# Altium schematic sheet CPU.SchDoc
size A3
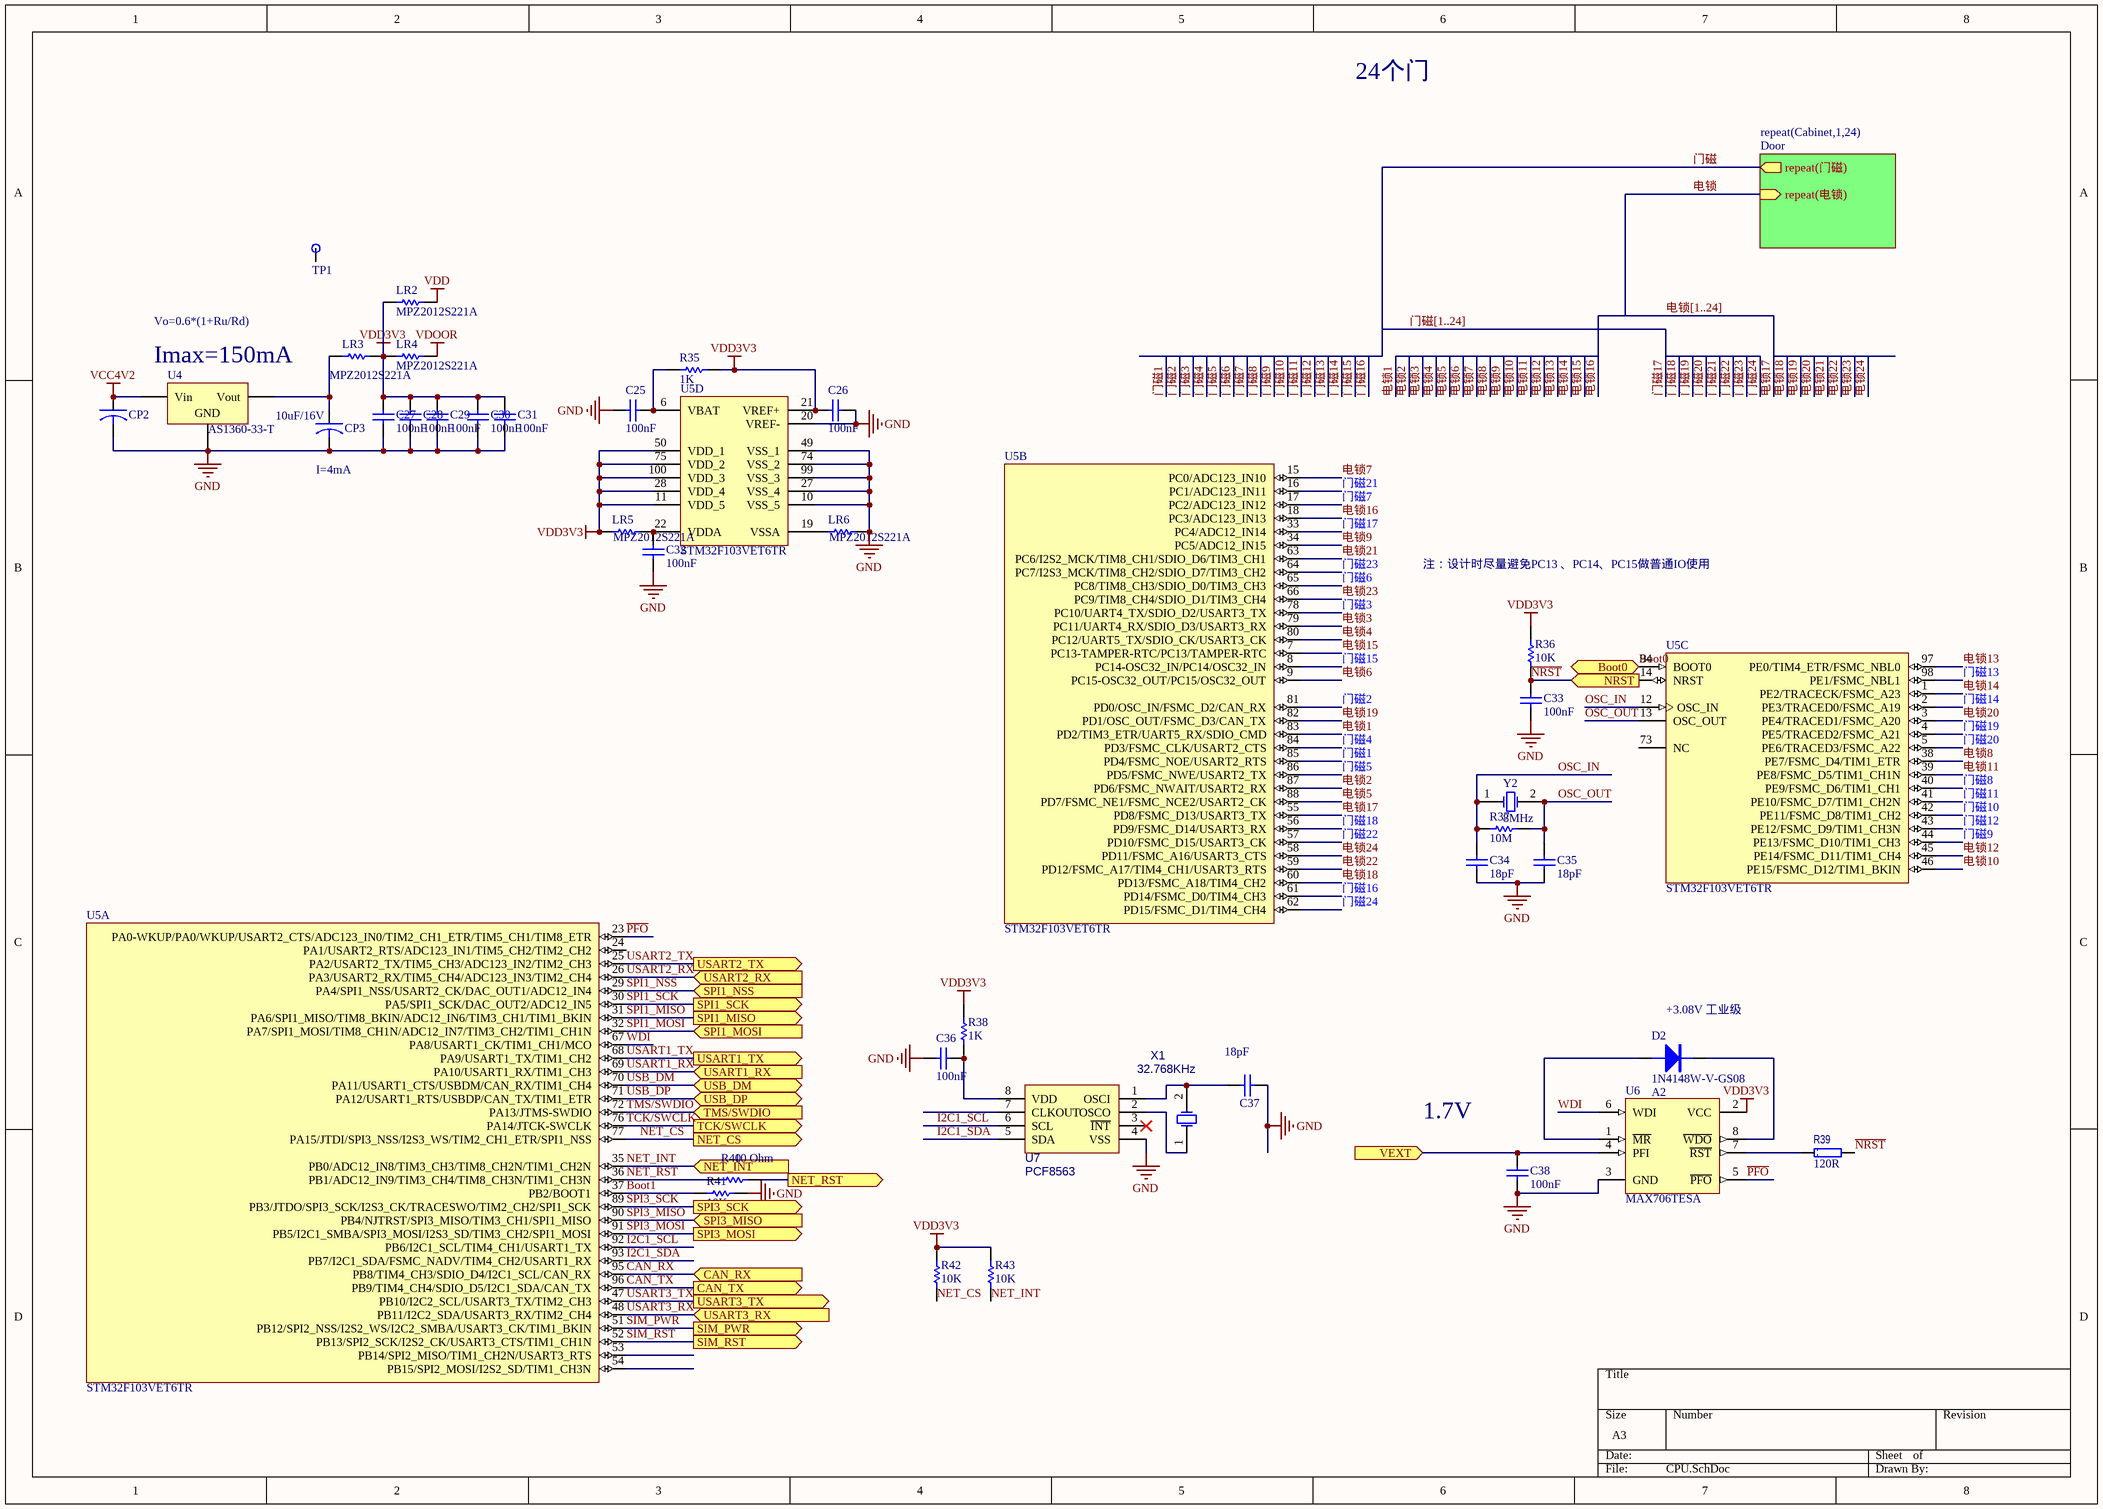
[diagram p0: CPU.SchDoc]

## Parts
C25  value 100nF  [2012[0805]06CD]  (hidden comment: CAP 100nF 50V 0805(2012))
C26  value 100nF  [2012[0805]06CD]  (hidden comment: CAP 100nF 50V 0805(2012))
C27  value 100nF  [2012[0805]06CD]  (hidden comment: CAP 100nF 50V 0805(2012))
C28  value 100nF  [2012[0805]06CD]  (hidden comment: CAP 100nF 50V 0805(2012))
C29  value 100nF  [2012[0805]06CD]  (hidden comment: CAP 100nF 50V 0805(2012))
C30  value 100nF  [2012[0805]06CD]  (hidden comment: CAP 100nF 50V 0805(2012))
C31  value 100nF  [2012[0805]06CD]  (hidden comment: CAP 100nF 50V 0805(2012))
C32  value 100nF  [2012[0805]06CD]  (hidden comment: CAP 100nF 50V 0805(2012))
C33  value 100nF  [2012[0805]06CD]  (hidden comment: CAP 100nF 50V 0805(2012))
C34  value 18pF  [2012[0805]100_L]  (hidden comment: CAP 18pF 50V 0805(2012))
C35  value 18pF  [2012[0805]100_L]  (hidden comment: CAP 18pF 50V 0805(2012))
C36  value 100nF  [2012[0805]06CD]  (hidden comment: CAP 100nF 50V 0805(2012))
C37  value 18pF  [2012[0805]100_L]  (hidden comment: CAP 18pF 50V 0805(2012))
C38  value 100nF  [2012[0805]06CD]  (hidden comment: CAP 100nF 50V 0805(2012))
CP2  TAJA106K016RNJ  [3216[1206]CB]  (value not drawn)
CP3  value 10uF/16V  [3216[1206]CB]  (hidden comment: TAJA106K016RNJ)
D2  1N4148W-V-GS08  value A2  [SOD123]
LR2  MPZ2012S221A  [2012[0805]RL]
LR3  MPZ2012S221A  [2012[0805]RL]
LR4  MPZ2012S221A  [2012[0805]RL]
LR5  MPZ2012S221A  [2012[0805]RL]
LR6  MPZ2012S221A  [2012[0805]RL]
R35  value 1K  [2012[0805]R]  (hidden comment: 1K 1% 0805(2012))
R36  value 10K  [2012[0805]R]  (hidden comment: 10K 1% 0805(2012))
R37  value 10M  [2012[0805]R]  (hidden comment: 10M 1% 0805(2012))
R38  value 1K  [2012[0805]R]  (hidden comment: 1K 1% 0805(2012))
R39  value 120R  [2012[0805]R]  (hidden comment: CRCW0603120RFKEA)
R40  value 10 Ohm  [2012[0805]R]  (hidden comment: 10R 5% 0805(2012))
R41  value 10K  [2012[0805]R]  (hidden comment: 10K 1% 0805(2012))
R42  value 10K  [2012[0805]R]  (hidden comment: 10K 1% 0805(2012))
R43  value 10K  [2012[0805]R]  (hidden comment: 10K 1% 0805(2012))
TP1  TP  [TP]  (value not drawn)
U4  AS1360-33-T  [SOT23_N]
U5  STM32F103VET6TR  [STM-LQFP100_M]  (parts A,B,C,D of 4)
U6  MAX706TESA  [SOIC8_N]
U7  PCF8563  [SOIC8_N]
X1  32.768KHz  [XTAL32]
Y2  8MHz  [XTAL_HC-49]

## Sub-sheets
repeat(Cabinet,1,24) = Door: repeat(门磁) (out), repeat(电锁) (in)

## Ports
Boot0 (in), CAN_RX (in), CAN_TX (out), NET_CS (out), NET_INT (in), NET_RST (out), NRST (in), SIM_PWR (out), SIM_RST (out), SPI1_MISO (out), SPI1_MOSI (in), SPI1_NSS (in), SPI1_SCK (out), SPI3_MISO (in), SPI3_MOSI (out), SPI3_SCK (out), TCK/SWCLK (out), TMS/SWDIO (in), USART1_RX (in), USART1_TX (out), USART2_RX (in), USART2_TX (out), USART3_RX (in), USART3_TX (out), USB_DM, USB_DP, VEXT (in)

## Nets
GND: C25.2 C26.2 C27.2 C28.2 C29.2 C30.2 C31.2 C32.2 C33.2 C34.2 C35.2 C36.2 C37.2 C38.2 CP2.2 CP3.2 LR6.2 R41.1 U4.1(GND) U5.10(VSS_5) U5.20(VREF-) U5.27(VSS_4) U5.49(VSS_1) U5.74(VSS_2) U5.99(VSS_3) U6.3(GND) U7.4(VSS)
VCC4V2: CP2.1 U4.3(Vin)
VDD: LR2.2
VDD3V3: C26.1 C27.1 C28.1 C29.1 C30.1 C31.1 LR2.1 LR3.1 LR4.1 LR5.1 R35.1 R36.2 R38.1 R42.1 R43.1 U5.11(VDD_5) U5.21(VREF+) U5.28(VDD_4) U5.50(VDD_1) U5.75(VDD_2) U5.100(VDD_3) U6.2(VCC)
VDOOR: LR4.2
Boot0: U5.94(BOOT0) ; port Boot0
Boot1: R41.2 U5.37(PB2/BOOT1)
CAN_RX: U5.95(PB8/TIM4_CH3/SDIO_D4/I2C1_SCL/CAN_RX) ; port CAN_RX
CAN_TX: U5.96(PB9/TIM4_CH4/SDIO_D5/I2C1_SDA/CAN_TX) ; port CAN_TX
I2C1_SCL: U5.92(PB6/I2C1_SCL/TIM4_CH1/USART1_TX) U7.6(SCL)
I2C1_SDA: U5.93(PB7/I2C1_SDA/FSMC_NADV/TIM4_CH2/USART1_RX) U7.5(SDA)
~{NRST}: C33.1 R36.1 R39.2 U5.14(NRST) ; port NRST
NET_CS: R42.2 U5.77(PA15/JTDI/SPI3_NSS/I2S3_WS/TIM2_CH1_ETR/SPI1_NSS) ; port NET_CS
NET_INT: R43.2 U5.35(PB0/ADC12_IN8/TIM3_CH3/TIM8_CH2N/TIM1_CH2N) ; port NET_INT
NET_RST: R40.2 U5.36(PB1/ADC12_IN9/TIM3_CH4/TIM8_CH3N/TIM1_CH3N)
NET_RST: R40.1 ; port NET_RST  [a separate net that carries the same name]
OSC_IN: C34.1 R37.1 U5.12(OSC_IN) Y2.1(OSC1)
OSC_OUT: C35.1 R37.2 U5.13(OSC_OUT) Y2.2(OSC2)
~{PFO}: U5.23(PA0-WKUP/PA0/WKUP/USART2_CTS/ADC123_IN0/TIM2_CH1_ETR/TIM5_CH1/TIM8_ETR) U6.5(~{PFO})
SIM_PWR: U5.51(PB12/SPI2_NSS/I2S2_WS/I2C2_SMBA/USART3_CK/TIM1_BKIN) ; port SIM_PWR
SIM_RST: U5.52(PB13/SPI2_SCK/I2S2_CK/USART3_CTS/TIM1_CH1N) ; port SIM_RST
SPI1_MISO: U5.31(PA6/SPI1_MISO/TIM8_BKIN/ADC12_IN6/TIM3_CH1/TIM1_BKIN) ; port SPI1_MISO
SPI1_MOSI: U5.32(PA7/SPI1_MOSI/TIM8_CH1N/ADC12_IN7/TIM3_CH2/TIM1_CH1N) ; port SPI1_MOSI
SPI1_NSS: U5.29(PA4/SPI1_NSS/USART2_CK/DAC_OUT1/ADC12_IN4) ; port SPI1_NSS
SPI1_SCK: U5.30(PA5/SPI1_SCK/DAC_OUT2/ADC12_IN5) ; port SPI1_SCK
SPI3_MISO: U5.90(PB4/NJTRST/SPI3_MISO/TIM3_CH1/SPI1_MISO) ; port SPI3_MISO
SPI3_MOSI: U5.91(PB5/I2C1_SMBA/SPI3_MOSI/I2S3_SD/TIM3_CH2/SPI1_MOSI) ; port SPI3_MOSI
SPI3_SCK: U5.89(PB3/JTDO/SPI3_SCK/I2S3_CK/TRACESWO/TIM2_CH2/SPI1_SCK) ; port SPI3_SCK
TCK/SWCLK: U5.76(PA14/JTCK-SWCLK) ; port TCK/SWCLK
TMS/SWDIO: U5.72(PA13/JTMS-SWDIO) ; port TMS/SWDIO
USART1_RX: U5.69(PA10/USART1_RX/TIM1_CH3) ; port USART1_RX
USART1_TX: U5.68(PA9/USART1_TX/TIM1_CH2) ; port USART1_TX
USART2_RX: U5.26(PA3/USART2_RX/TIM5_CH4/ADC123_IN3/TIM2_CH4) ; port USART2_RX
USART2_TX: U5.25(PA2/USART2_TX/TIM5_CH3/ADC123_IN2/TIM2_CH3) ; port USART2_TX
USART3_RX: U5.48(PB11/I2C2_SDA/USART3_RX/TIM2_CH4) ; port USART3_RX
USART3_TX: U5.47(PB10/I2C2_SCL/USART3_TX/TIM2_CH3) ; port USART3_TX
USB_DM: U5.70(PA11/USART1_CTS/USBDM/CAN_RX/TIM1_CH4) ; port USB_DM
USB_DP: U5.71(PA12/USART1_RTS/USBDP/CAN_TX/TIM1_ETR) ; port USB_DP
VEXT: C38.1 U6.4(PFI) ; port VEXT
WDI: U5.67(PA8/USART1_CK/TIM1_CH1/MCO) U6.6(WDI)
电锁: sheet repeat(Cabinet,1,24)/repeat(电锁)
电锁1: U5.83(PD2/TIM3_ETR/UART5_RX/SDIO_CMD)
电锁2: U5.87(PD6/FSMC_NWAIT/USART2_RX)
电锁3: U5.79(PC11/UART4_RX/SDIO_D3/USART3_RX)
电锁4: U5.80(PC12/UART5_TX/SDIO_CK/USART3_CK)
电锁5: U5.88(PD7/FSMC_NE1/FSMC_NCE2/USART2_CK)
电锁6: U5.9(PC15-OSC32_OUT/PC15/OSC32_OUT)
电锁7: U5.15(PC0/ADC123_IN10)
电锁8: U5.38(PE7/FSMC_D4/TIM1_ETR)
电锁9: U5.34(PC5/ADC12_IN15)
电锁10: U5.46(PE15/FSMC_D12/TIM1_BKIN)
电锁11: U5.39(PE8/FSMC_D5/TIM1_CH1N)
电锁12: U5.45(PE14/FSMC_D11/TIM1_CH4)
电锁13: U5.97(PE0/TIM4_ETR/FSMC_NBL0)
电锁14: U5.1(PE2/TRACECK/FSMC_A23)
电锁15: U5.7(PC13-TAMPER-RTC/PC13/TAMPER-RTC)
电锁16: U5.18(PC3/ADC123_IN13)
电锁17: U5.55(PD8/FSMC_D13/USART3_TX)
电锁18: U5.60(PD13/FSMC_A18/TIM4_CH2)
电锁19: U5.82(PD1/OSC_OUT/FSMC_D3/CAN_TX)
电锁20: U5.3(PE4/TRACED1/FSMC_A20)
电锁21: U5.63(PC6/I2S2_MCK/TIM8_CH1/SDIO_D6/TIM3_CH1)
电锁22: U5.59(PD12/FSMC_A17/TIM4_CH1/USART3_RTS)
电锁23: U5.66(PC9/TIM8_CH4/SDIO_D1/TIM3_CH4)
电锁24: U5.58(PD11/FSMC_A16/USART3_CTS)
门磁: sheet repeat(Cabinet,1,24)/repeat(门磁)
门磁1: U5.85(PD4/FSMC_NOE/USART2_RTS)
门磁2: U5.81(PD0/OSC_IN/FSMC_D2/CAN_RX)
门磁3: U5.78(PC10/UART4_TX/SDIO_D2/USART3_TX)
门磁4: U5.84(PD3/FSMC_CLK/USART2_CTS)
门磁5: U5.86(PD5/FSMC_NWE/USART2_TX)
门磁6: U5.65(PC8/TIM8_CH3/SDIO_D0/TIM3_CH3)
门磁7: U5.17(PC2/ADC123_IN12)
门磁8: U5.40(PE9/FSMC_D6/TIM1_CH1)
门磁9: U5.44(PE13/FSMC_D10/TIM1_CH3)
门磁10: U5.42(PE11/FSMC_D8/TIM1_CH2)
门磁11: U5.41(PE10/FSMC_D7/TIM1_CH2N)
门磁12: U5.43(PE12/FSMC_D9/TIM1_CH3N)
门磁13: U5.98(PE1/FSMC_NBL1)
门磁14: U5.2(PE3/TRACED0/FSMC_A19)
门磁15: U5.8(PC14-OSC32_IN/PC14/OSC32_IN)
门磁16: U5.61(PD14/FSMC_D0/TIM4_CH3)
门磁17: U5.33(PC4/ADC12_IN14)
门磁18: U5.56(PD9/FSMC_D14/USART3_RX)
门磁19: U5.4(PE5/TRACED2/FSMC_A21)
门磁20: U5.5(PE6/TRACED3/FSMC_A22)
门磁21: U5.16(PC1/ADC123_IN11)
门磁22: U5.57(PD10/FSMC_D15/USART3_CK)
门磁23: U5.64(PC7/I2S3_MCK/TIM8_CH2/SDIO_D7/TIM3_CH2)
门磁24: U5.62(PD15/FSMC_D1/TIM4_CH4)
NetC25_1: C25.1 R35.2 U5.6(VBAT)
NetC32_1: C32.1 LR5.2 U5.22(VDDA)
NetC36_1: C36.1 R38.2 U7.8(VDD)
NetC37_1: C37.1 U7.1(OSCI) X1.2(OSC2)
NetCP3_1: CP3.1 LR3.2 U4.2(Vout)
NetD2_1: D2.1(A) U6.1(~{MR})
NetD2_2: D2.2(K) U6.8(~{WDO})
NetLR6_1: LR6.1 U5.19(VSSA)
NetR39_1: R39.1 U6.7(~{RST})
NetU7_2: U7.2(OSCO) X1.1(OSC1)

Not connected (* = marked no-connect by the designer): TP1 1(TestPoint); U5 24(PA1/USART2_RTS/ADC123_IN1/TIM5_CH2/TIM2_CH2) 53(PB14/SPI2_MISO/TIM1_CH2N/USART3_RTS) 54(PB15/SPI2_MOSI/I2S2_SD/TIM1_CH3N) 73(NC); U7 3(~{INT})* 7(CLKOUT)

## Buses and harness runs
bus 电锁[1..24]
bus 门磁[1..24]

## Notes on the sheet
- 24个门
- (near U4) Imax=150mA
- Vo=0.6*(1+Ru/Rd)
- (near CP3) I=4mA
- 注：设计时尽量避免PC13 、PC14、PC15做普通IO使用
- (near D2) +3.08V 工业级
- 1.7V

## Library data of the parts
C25-C32 C36 = CMP-1036-04418-1: CAP 100nF 50V ±5% 0805 (2012 Metric) Thickness 1mm SMD; Case-EIA: 0805; Case-Metric: 2012; Tolerance: ±5%; Max Thickness: 1 mm; Technology: SMT; Rated Voltage: 50 V
C33 C38 = CMP-1036-04417-1: CAP 100nF 50V ±5% 0805 (2012 Metric) Thickness 1.45mm SMD; Case-Metric: 2012; Case-EIA: 0805; Max Thickness: 1.45 mm; Tolerance: ±5%; Rated Voltage: 50 V; Technology: SMT
C34 C35 C37 = CMP-1036-01136-1: CAP 18pF 50V ±1% 0805 (2012 Metric) Thickness 0.75mm SMD; Case-EIA: 0805; Case-Metric: 2012; Technology: SMT; Tolerance: ±1%; Max Thickness: 0.75 mm; Rated Voltage: 50 V
CP2 CP3 = CAPACITOR: 钽质电容器-固体SMD 16volts 10uF 10%; Manufacturer: AVX; ESR: 3 Ohms; 产品: Tantalum Solid Standard Grade - Other Various; 产品种类: SMD Tantalum Capacitors; 制造商库存号: A Case; 外壳代码 - in: 1206; 外壳代码 - mm: 3216; 封装 / 箱体: 1206 (3216 metric); 封装: Reel; 尺寸: 1.6 mm W x 3.2 mm L; 工作温度范围: - 55 C to + 125 C; 损耗因数 DF: 8; 标准包装数量: 2000; 漏泄电流: 1.6 uA; 电压额定值: 16 V; 端接类型: SMD/SMT; 系列: TAJ; 高度: 1.8 mm; Category: 钽质电容器-固体SMD; ComponentLink1Description: http://www.avx.com/docs/Catalogs/taj.pdf; ComponentLink1URL: http://www.avx.com/docs/Catalogs/taj.pdf; Description 1: 钽质电容器-固体SMD 16volts 10uF 10%; Manufacturer Part Number: TAJA106K016RNJ; Minimum Order Quantity: 1; Pricing 1: 1=0.600, 100=0.280, 200=0.250, 500=0.221, 1000=0.200, 2000=0.140, 5000=0.131, 10000=0.124, 25000=0.103 (USD); Reeling: True; RoHS - 贸泽: Y; RoHS: RoHS Compliant; Stock 1: 20335; Supplier 1: Mouser; Supplier Part Number 1: 581-TAJA106K016R; 制造商: AVX; 容差: 10 %; 电容: 10 uF
D2 = 1N4148W: 二极管 - 通用，功率，开关 100V Io/150mA; Manufacturer: Vishay Semiconductors; 配置: Single; 工作温度范围: - 65 C to + 150 C; 封装 / 箱体: SOD-123; 封装: Reel; 产品: Switching Diodes; 正向连续电流: 0.15 A; 最大浪涌电流: 0.5 A; 安装风格: SMD/SMT; 恢复时间: 4 ns; 正向电压下降: 1.2 V; 制造商: Vishay; 最大二极管电容: 4 pF; 最大工作温度: + 150 C; 最大功率耗散: 350 mW; 最大反向漏泄电流: 5 uA; 最小工作温度: - 65 C; 标准包装数量: 15000; Supplier 1: Mouser; Supplier Part Number 1: 625-1N4148W-V; Manufacturer Part Number: 1N4148W-V-GS08; RoHS: RoHS Compliant; Category: 二极管 - 通用，功率，开关; Stock 1: 404148; Pricing 1: 1=0.090, 10=0.083, 50=0.072, 100=0.068, 500=0.032, 1000=0.026, 3000=0.021, 9000=0.016, 10000=0.016, 18000=0.014 (USD); 峰值反向电压: 100 V; 产品种类: Switching Diodes; RoHS - 贸泽: Y; Minimum Order Quantity: 1; Reeling: True; ComponentLink1URL: http://www.mouser.com/ds/2/427/1n4148w--240387.pdf; ComponentLink1Description: http://www.mouser.com/ds/2/427/1n4148w--240387.pdf; Description 1: 二极管 - 通用，功率，开关 100V Io/150mA
LR2-LR6 = Res Semi: 电磁干扰滤波珠子、扼流圈和阵列 Ferrite Chip Beads; Manufacturer: TDK; 阻抗: 220 Ohms; 最大直流电流: 3 A; 最大直流电阻: 0.04 Ohms; 工作温度范围: - 55 C to + 125 C; 封装 / 箱体: 2012; 封装: Reel; 端接类型: SMD/SMT; 容差: 25 %; 产品种类: Ferrite Beads; 标准包装数量: 4000; Supplier 1: Mouser; Supplier Part Number 1: 810-MPZ2012S221A; Manufacturer Part Number: MPZ2012S221A; RoHS: RoHS Compliant; Description 1: 电磁干扰滤波珠子、扼流圈和阵列 Ferrite Chip Beads; Category: 电磁干扰滤波珠子、扼流圈和阵列; Stock 1: 26540; Pricing 1: 1=0.070, 50=0.060, 100=0.053, 500=0.040, 1000=0.035, 4000=0.031, 8000=0.029, 12000=0.025 (USD); 制造商: TDK; RoHS - 贸泽: Y; Minimum Order Quantity: 1; Reeling: True; ComponentLink1URL: http://www.mouser.com/ds/2/400/e9413_mpz-24582.pdf; ComponentLink1Description: http://www.mouser.com/ds/2/400/e9413_mpz-24582.pdf
R35 R38 = CMP-1013-00510-1: 1K 0.125W 1% 0805 (2012 Metric)  SMD; Case-Metric: 2012; Case-EIA: 0805; Tolerance: 1 %; Power: 0.125 W; Technology: SMT
R36 R41-R43 = CMP-1013-00623-1: 10K 0.125W 1% 0805 (2012 Metric)  SMD; Case-Metric: 2012; Case-EIA: 0805; Tolerance: 1 %; Power: 0.125 W; Technology: SMT
R37 = CMP-1013-00962-1: 10M 0.125W 1% 0805 (2012 Metric)  SMD; Case-EIA: 0805; Case-Metric: 2012; Tolerance: 1 %; Power: 0.125 W; Technology: SMT
R39 = RES: 厚膜电阻器 - SMD 1/10watt 120ohms 1%; Manufacturer: Vishay / Dale; 尺寸: 0.85 mm W x 1.55 mm L x 0.45 mm H; 工作温度范围: - 55 C to + 155 C; 封装 / 箱体: 0603 (1608 metric); 封装: Reel; 功率额定值: 100 mW; 产品: Thick Film Resistors SMD; 系列: CRCW; 温度系数: 100 PPM / K; 端接类型: SMD/SMT; 电压额定值: 75 V; 外壳代码 - in: 0603; 外壳代码 - mm: 1608; 制造商: Vishay; 产品种类: 0603 Thick Film Chip Resistors; 标准包装数量: 5000; Supplier 1: Mouser; Supplier Part Number 1: 71-CRCW0603-120-E3; Manufacturer Part Number: CRCW0603120RFKEA; RoHS: RoHS Compliant By Exemption; Category: 厚膜电阻器 - SMD; Stock 1: 11148; Pricing 1: 1=0.080, 10=0.013, 100=0.010, 1000=0.008, 5000=0.005, 25000=0.004, 50000=0.003 (USD); 电阻: 120 Ohms; 容差: 1 %; RoHS - 贸泽: E; Minimum Order Quantity: 1; Reeling: True; ComponentLink1URL: http://www.mouser.com/ds/2/427/dcrcwe3-109170.pdf; ComponentLink1Description: http://www.mouser.com/ds/2/427/dcrcwe3-109170.pdf; Description 1: 厚膜电阻器 - SMD 1/10watt 120ohms 1%
R40 = CMP-1013-00026-1: 10R 0.125W 5% 0805 (2012 Metric)  SMD; Case-EIA: 0805; Case-Metric: 2012; Technology: SMT; Power: 0.125 W; Tolerance: 5 %
TP1 = Test Point
U4 = Volt Reg: LDO Voltage Controllers; Manufacturer: ams; Input Voltage MAX: 20 V; Output Current: 150 mA; Output Voltage: 3.3 V; Product Status: New at Mouser; Supplier 1: Mouser; Supplier Part Number 1: 985-AS1360-33-T; Manufacturer Part Number: AS1360-33-T; RoHS: RoHS Compliant; Category: LDO Voltage Controllers; Stock 1: 4086; Pricing 1: 1=1.82, 10=1.46, 100=1.12, 500=0.991, 1000=0.783, 2500=0.730, 5000=0.695, 10000=0.680 (AUD); Package / Case: SOT-23-3; Packaging: Reel; Mounting Style: SMD/SMT; Maximum Operating Temperature: + 85 C; Minimum Operating Temperature: - 40 C; RoHS - Mouser: Y; Minimum Order Quantity: 1; Reeling: True; ComponentLink1URL: http://ams.com/eng/content/download/1325/7334/424; ComponentLink1Description: http://ams.com/eng/content/download/1325/7334/424
U5 = CMP-0237-00166-2: ARM Cortex-M3 32-bit MCU, 512 KB Flash, 64 KB Internal RAM, 80 I/Os, 100-pin LQFP, -40 to 85 degC, Tape and Reel; D/A Converter: 2x12-bit (2 Channel); I/Os (High Current): 80; Supply Voltage(Vcc) min (V): 2; Operating Frequency(F) (Processor speed) (MHz): 72; A/D Converter: 3x12-bit (16 Channel); FLASH Size (Prog) (kB): 512; Internal RAM Size (kB): 64; Mounting Technology: Surface Mount; ComponentLink2URL: http://www.st.com/st-web-ui/static/active/en/resource/technical/document/datasheet/CD00191185.pdf; ComponentLink1Description: Manufacturer URL; PackageReference: LQFP100; ComponentLink2Description: Datasheet; PackageVersion: Rev. 1, 06/2013; Core: ARM Cortex-M3; ComponentLink3URL: http://www.st.com/st-web-ui/static/active/en/resource/technical/document/data_brief/DM00071938.pdf; ComponentLink3Description: Package Specification; DatasheetVersion: Rev. 8; PartNumber: STM32F103VET6TR; Packing: Tape and Reel; ComponentLink1URL: http://www.st.com/web/en/home.html; PackageDescription: 100-Pin Low Profile Quad Flat Package, 14 x 14 mm Body, 0.5 mm Pitch
U6 = MAX706TESA: +3V Voltage Monitoring, Low-Cost, 礟 Supervisory Circuit; Published: 16-Jan-2001; LatestRevisionDate: 13-Apr-2006; LatestRevisionNote: IPC-7351 Footprint Added.; DatasheetVersion: Sep-1995; PackageReference: NSO8; Publisher: Altium Limited; PackageDescription: 8-Pin Small Outline Integrated Circuit 1.27 mm Pitch; Code_JEDEC: MS-012-AA; Code_IPC: SOIC127P600-8; ComponentLink1Description: Manufacturer Link; ComponentLink1URL: http://www.maxim-ic.com/; ComponentLink2Description: Datasheet; ComponentLink2URL: http://pdfserv.maxim-ic.com/en/ds/MAX706P-MAX708T.pdf
U7 = PCF8563: RTC时钟
X1 Y2 = XTAL: Crystal Oscillator
  X1: Published: *; LatestRevisionDate: *; LatestRevisionNote: *; PackageReference: *; Publisher: *
  Y2: Published: 8-Jun-2000; LatestRevisionDate: 17-Jul-2002; LatestRevisionNote: Re-released for DXP Platform.; Publisher: Altium Limited